# Altium schematic sheet Relay_Interface.SchDoc
size A4; Author: Esteban Durán Madrid; CompanyName: Universidad de Santiago de Chile; Address1: Avenida Ecuador Nº 3519; Address2: Estación Central, Santiago; Address3: Chile; DocumentNumber: 4; SheetNumber: 4; SheetTotal: 4
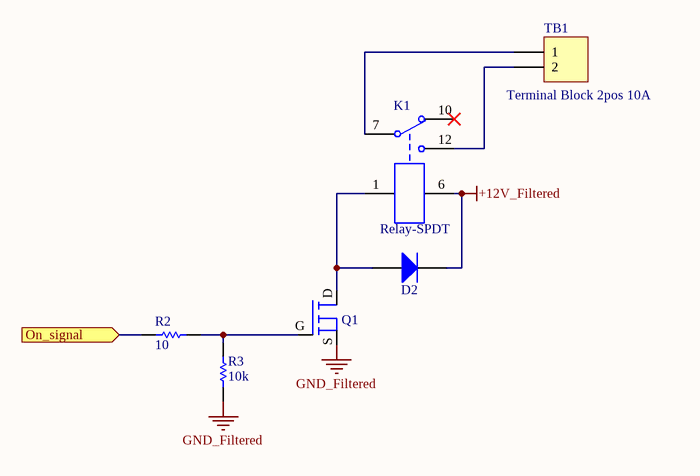
[diagram p0: Relay_Interface.SchDoc]

## Parts
D2  Diode GEN PURP  [SOT-23]  (value not drawn)
K1  Relay-SPDT  [RELAY_SPDT]
Q1  MOSFET N  [SOT23_MOD]  (value not drawn)
R2  10  [RES_0603]
R3  10k  [RES_0603]
TB1  Terminal Block 2pos 10A  [Terminal Block 2 pos 8A]

## Ports
On_signal (in)

## Nets
+12V_Filtered: D2.3(K) K1.6
GND_Filtered: Q1.S R3.2
On_signal: R2.1 ; port On_signal
NetD2_1: D2.1(A) K1.1 Q1.D
NetK1_7: K1.7(COM) TB1.1
NetK1_12: K1.12(NO) TB1.2
NetQ1_G: Q1.G R2.2 R3.1

Not connected (* = marked no-connect by the designer): D2 2(NC); K1 10(NC)*

## Notes on the sheet
- Title
- Size:
- Date:
- A4
- Revision:
- Time:
- Sheet
- of
- Author:
- Project:

## Library data of the parts
D2 = Diode GEN PURP: DIODE GEN PURP 100V 200MA SOT23; Manufacturer Part-Number: BAS16LT1G; Digikey Part-Number: BAS16LT1GOSCT-ND
K1 = Relay-SPDT: Relay SPDT 12V Coil; Manufacturer Part-Number: DS1E-M-DC12V; Digikey Part-Number: 255-1473-ND
Q1 = MOSFET_N: 2N7002-FDICT-ND; Manufacturer Part-Number: 2N7002-7-F; Digikey Part-Number: 2N7002-FDICT-ND
R2 = Res0603: Manufacturer Part-Number: ESR03EZPF10R0; Digikey Part-Number: RHM10.0ADCT-ND; Value: 10
R3 = Res0603: Manufacturer Part-Number: RC0603FR-0710KL; Digikey Part-Number: 311-10.0KHRCT-ND; Value: 10k
TB1 = Terminal Block 2 pos 8A pitch 5mm: Wurth Electronics Inc.; Manufacturer Part-Number: 691111710002; Digikey Part-Number: 732-2030-ND